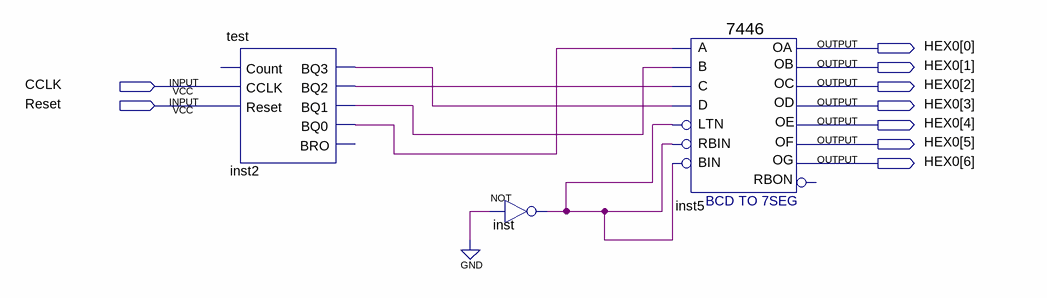
[diagram p0: schematic sheet]
// Quartus schematic 7segbcd.bdf as structural Verilog: 3 symbols, 9 pins
module \7segbcd  (
  input  CCLK,
  input  Reset,
  output [6:0] HEX0
);

  wire inst2_bq0, inst2_bq1, inst2_bq2, inst2_bq3, inst_out;

  test inst2 (
    .CCLK(CCLK), .Reset(Reset), .BQ3(inst2_bq3), .BQ2(inst2_bq2), .BQ1(inst2_bq1), .BQ0(inst2_bq0));  // open: Count, BRO
  not inst (inst_out, 1'b0);
  \7446  inst5 (
    .D(inst2_bq3), .C(inst2_bq2), .B(inst2_bq1), .LTN(inst_out), .A(inst2_bq0), .RBIN(inst_out),
    .BIN(inst_out), .OC(HEX0[2]), .OD(HEX0[3]), .OE(HEX0[4]), .OA(HEX0[0]), .OB(HEX0[1]), .OF(HEX0[5]),
    .OG(HEX0[6]));  // open: RBON
endmodule
